# Altium schematic sheet ee207 week 3 lab.SchDoc
size A4; SheetNumber: 1; SheetTotal: 1
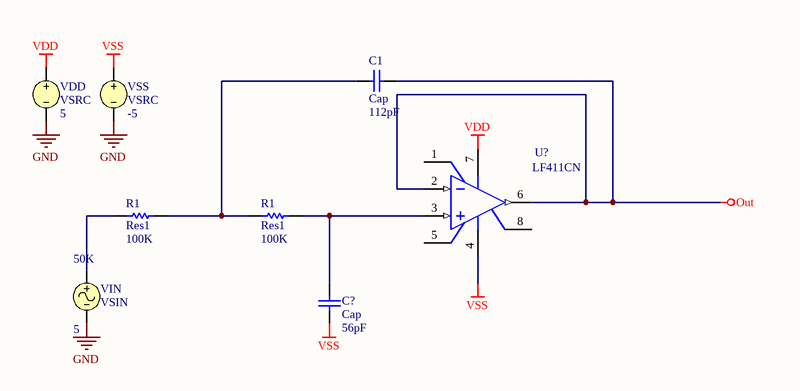
[diagram p0: ee207 week 3 lab.SchDoc]

## Parts
(Parts that share a designator on the sheet are numbered #1, #2 ... from top to bottom, then left to right.)
C1  Cap  value 112pF  [RAD-0.3]
C?  Cap  value 56pF  [RAD-0.3]
R1#1  Res1  value 100K  [AXIAL-0.3]
R1#2  Res1  value 100K  [AXIAL-0.3]
U?  LF411CN  [N08E]
VDD  VSRC  value 5
VIN  VSIN  Frequency: 50K  DC Magnitude: 5
VSS  VSRC  value -5

## Nets
GND: VDD.2 VIN.2 VSS.2
Out : C1.2 U?.2(IN-) U?.6(OUT)
VDD: U?.7(V+) VDD.1
VSS: C?.1 U?.4(V-) VSS.1
NetC1_1: C1.1 R1#1.2 R1#2.1
NetC?_2: C?.2 R1#2.2 U?.3(IN+)
NetR1#1_1: R1#1.1 VIN.1

Not connected (* = marked no-connect by the designer): U? 1(BAL) 5(BAL) 8(NC)

## Library data of the parts
C1 C? = Cap: Capacitor; Published: 8-Jun-2000; LatestRevisionDate: 17-Jul-2002; LatestRevisionNote: Re-released for DXP Platform.; PackageReference: RAD-0.3; Publisher: Altium Limited; PackageDescription: Radial Cap, Thru-Hole; 2 Leads; 0.3 in Pin Spacing
R1#1 R1#2 = Res1: Resistor; Published: 8-Jun-2000; LatestRevisionDate: 17-Jul-2002; LatestRevisionNote: Re-released for DXP Platform.; PackageReference: AXIAL-0.3; Publisher: Altium Limited; PackageDescription: Axial Device, Thru-Hole; 2 Leads; 0.3 in Pin Spacing
U? = CMP-0055-00213-2: Low Offset, Low Drift JFET Input Operational Amplifier, 8-pin MDIP; Manufacturer: National Semiconductor; PackageTopMarking: NSUZXYTTE#*LF*411CN; CompType: Amplifiers; PowerWise: N; PackageVersion: revG, May-2006; PackageReference: N08E; RoHS: N; ComponentLink2Description: LF411 Web Page; ComponentLink2URL: http://www.national.com/pf/LF/LF411.html; PinCount: 8; ComponentLink1Description: LF411 Datasheet; ComponentLink3Description: N08E Package Page; Code_JEDEC: MS-001-BA; DatasheetVersion: Aug-2000; PackageDescription: MDIP, .365 x .250 x .130in, 8 Lead, .100in Pitch; ComponentLink1URL: http://www.national.com/ds/LF/LF411.pdf; ComponentLink3URL: http://www.national.com/packaging/folders/n08e.html; RevisionNote: Component URLs added
VDD VSS = VSRC: Voltage Source; Note: PCB Footprint - Not required; AC Magnitude: 1; AC Phase: 0; Published: 30-July-2020; LatestRevisionDate: 30-July-2020; LatestRevisionNote: Re-released for DXP Platform.; PackageReference: Not Applicable; Publisher: Altium Limited
VIN = VSIN: Sinusoidal Voltage Source; Note: PCB Footprint - Not required; Offset: 0; Amplitude: 1; Published: 8-Jun-2000; LatestRevisionDate: 15-Nov-2004; LatestRevisionNote: Corrected Netlist.; PackageReference: Not Applicable; Publisher: Altium Limited; Delay: 0; Damping Factor: 0; Phase: 0; AC Magnitude: 1; AC Phase: 0